# Altium project BLDC_2024_MCU_BOARD.PrjPcb
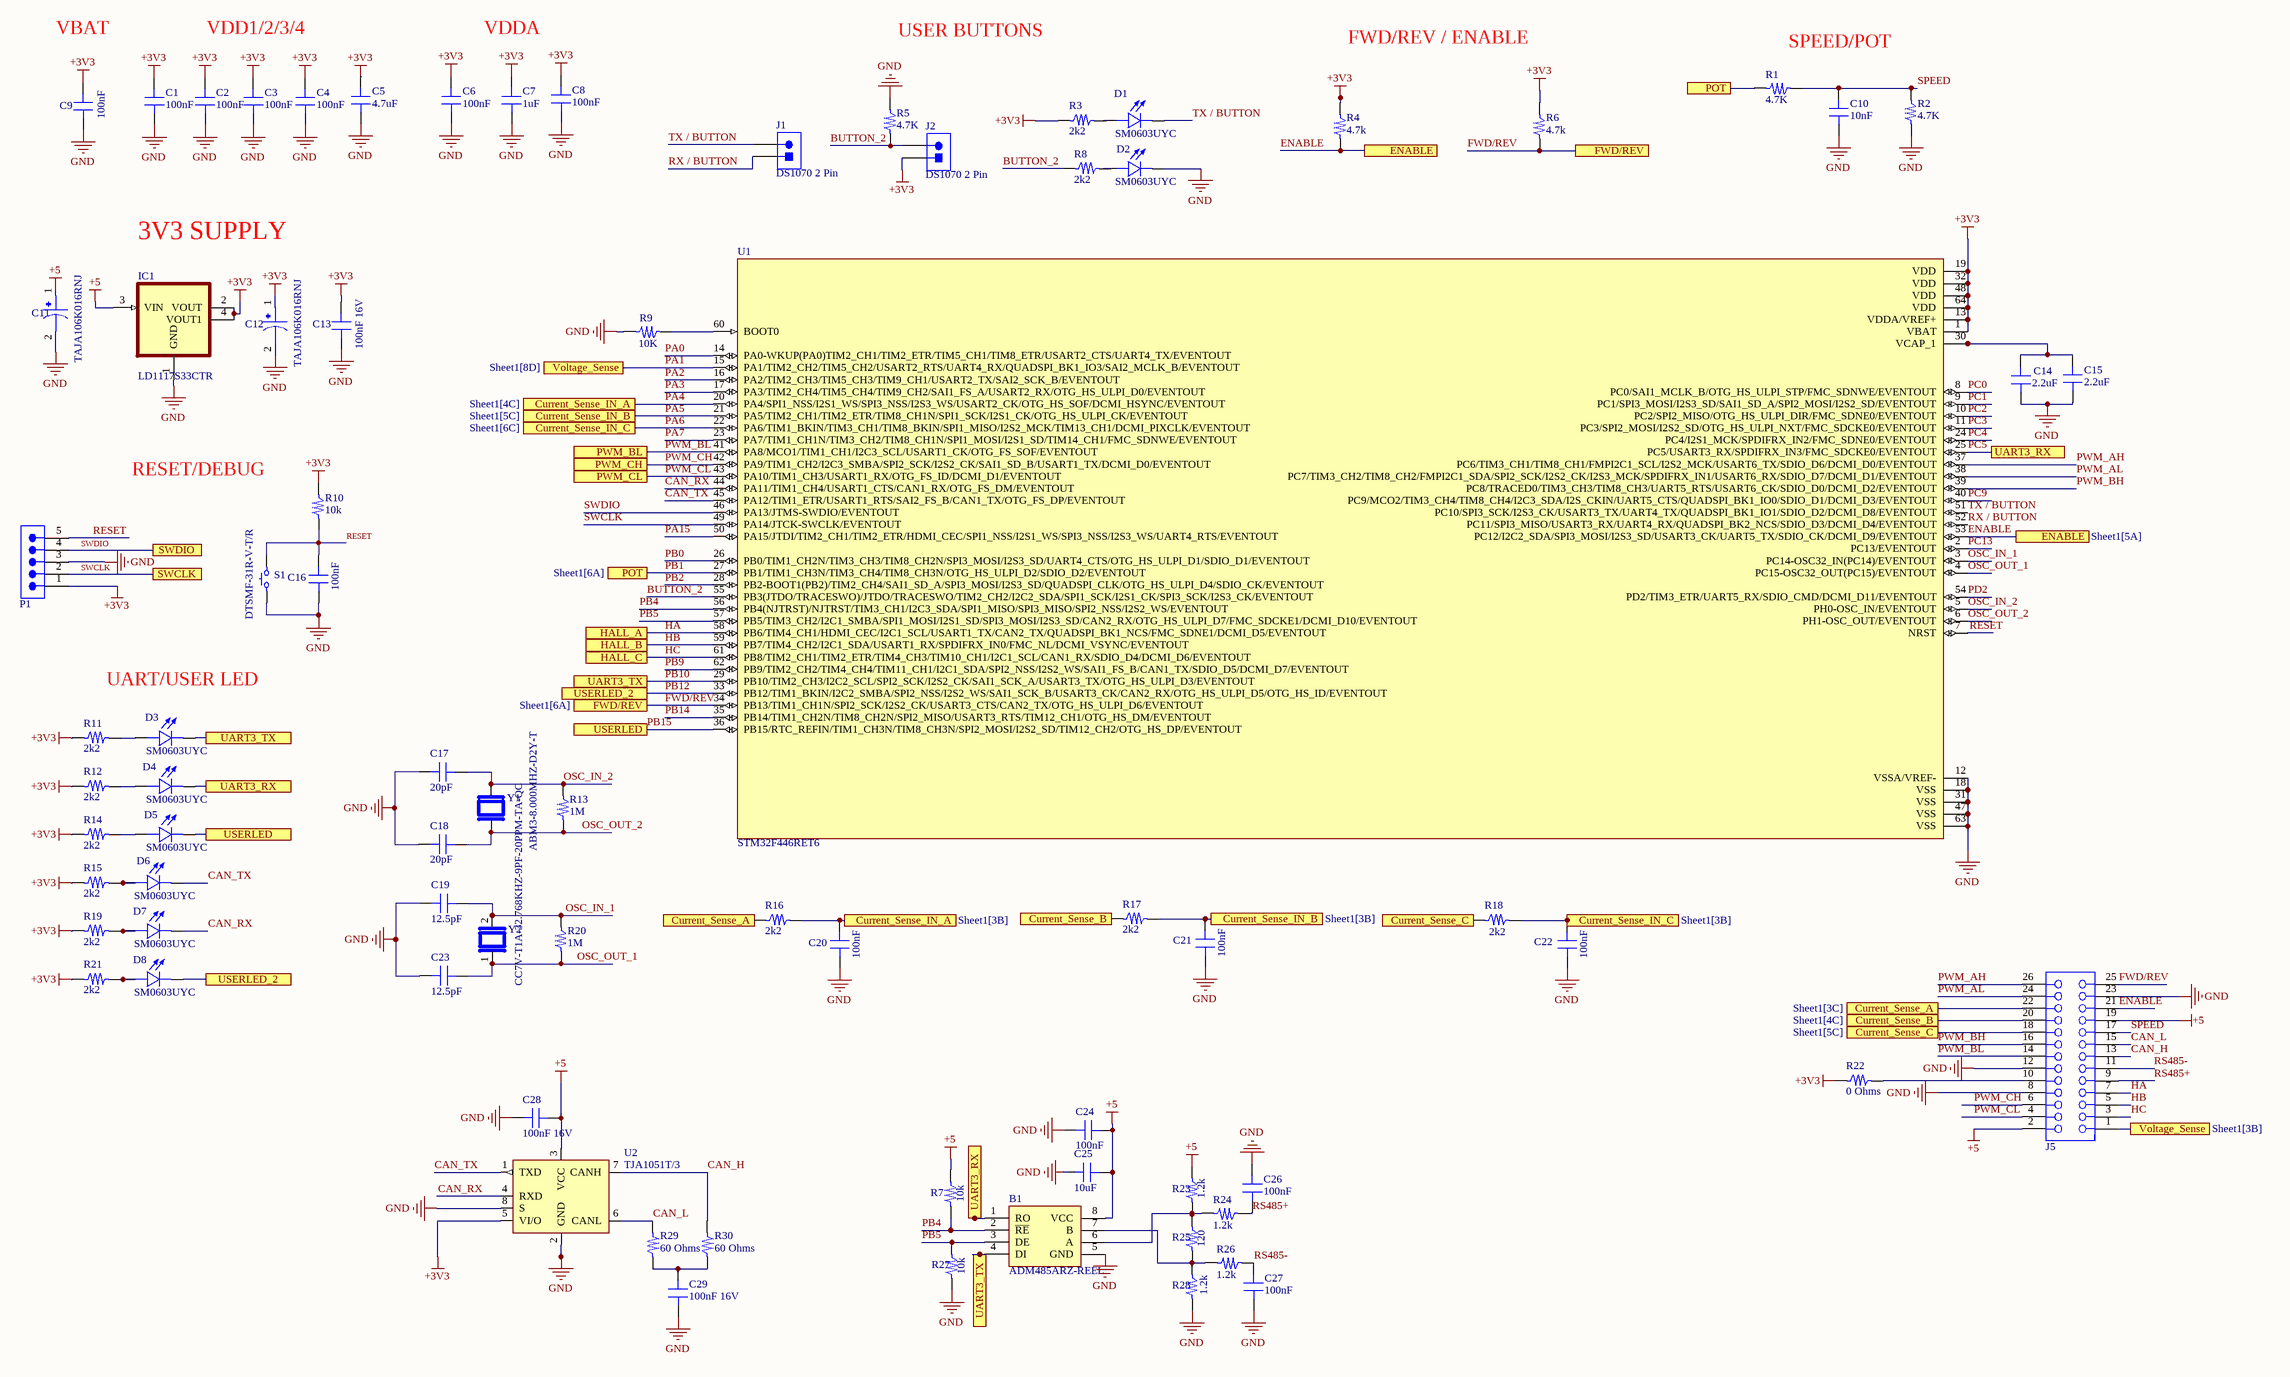
[diagram p0: Sheet1.SchDoc]
1 sheet, 78 parts. Net scope: flat (ports and power ports of the same name join across sheets).
Board file: PCB2.PcbDoc

## Sheet Sheet1.SchDoc
size A2; SheetNumber: 1; SheetTotal: 1

### Parts
B1  ADM485ARZ-REEL  [SOIC127P600X175-8N]
C1  100nF  [0603_CAP]
C2  100nF  [0603_CAP]
C3  100nF  [0603_CAP]
C4  100nF  [0603_CAP]
C5  4.7uF  [0603_CAP]
C6  100nF  [0603_CAP]
C7  1uF  [0603_CAP]
C8  100nF  [0603_CAP]
C9  100nF  [0603_CAP]
C10  10nF  [0603_CAP]
C11  TAJA106K016RNJ  [CAPMP3216X180N]
C12  TAJA106K016RNJ  [CAPMP3216X180N]
C13  100nF 16V  [0805_CAP]
C14  2.2uF  [0603_CAP]
C15  2.2uF  [0603_CAP]
C16  100nF  [0603_CAP]
C17  20pF  [0603_CAP]
C18  20pF  [0603_CAP]
C19  12.5pF  [0603_CAP]
C20  100nF  [0603_CAP]
C21  100nF  [0603_CAP]
C22  100nF  [0603_CAP]
C23  12.5pF  [0603_CAP]
C24  100nF  [0603_CAP]
C25  10uF  [0603_CAP]
C26  100nF  [0603_CAP]
C27  100nF  [0603_CAP]
C28  100nF 16V  [0603_CAP]
C29  100nF 16V  [0603_CAP]
D1  SM0603UYC  [LED_SM0603UYC]
D2  SM0603UYC  [LED_SM0603UYC]
D3  SM0603UYC  [LED_SM0603UYC]
D4  SM0603UYC  [LED_SM0603UYC]
D5  SM0603UYC  [LED_SM0603UYC]
D6  SM0603UYC  [LED_SM0603UYC]
D7  SM0603UYC  [LED_SM0603UYC]
D8  SM0603UYC  [LED_SM0603UYC]
IC1  LD1117S33CTR  [SOT223]
J1  DS1070 2 Pin  [2PIN_100mil]
J2  DS1070 2 Pin  [2PIN_100mil]
J5  61302621821  [61302621821]  (value not drawn)
P1  61300511121  [61300511121]  (value not drawn)
R1  4.7K  [0603_RES]
R2  4.7K  [0603_RES]
R3  2k2  [0603_RES]
R4  4.7k  [0603_RES]
R5  4.7K  [0603_RES]
R6  4.7k  [0603_RES]
R7  10k  [0603_RES]
R8  2k2  [0603_RES]
R9  10K  [0603_RES]
R10  10k  [0603_RES]
R11  2k2  [0603_RES]
R12  2k2  [0603_RES]
R13  1M  [0603_RES]
R14  2k2  [0603_RES]
R15  2k2  [0603_RES]
R16  2k2  [0603_RES]
R17  2k2  [0603_RES]
R18  2k2  [0603_RES]
R19  2k2  [0603_RES]
R20  1M  [0603_RES]
R21  2k2  [0603_RES]
R22  0 Ohms  [0805_RES]
R23  1.2k  [0603_RES]
R24  1.2k  [0603_RES]
R25  120  [0603_RES]
R26  1.2k  [0603_RES]
R27  10k  [0603_RES]
R28  1.2k  [0603_RES]
R29  60 Ohms  [0603_RES]
R30  60 Ohms  [0603_RES]
S1  DTSMF-31R-V-T/R  [Button]
U1  STM32F446RET6  [QFP50P1200X1200X160-64N]
U2  TJA1051T/3  [SOT96-1]
Y1  ABM3-8.000MHZ-D2Y-T  [XTAL_ABM3-8.000MHZ-D2Y-T]
Y2  CC7V-T1A-32.768KHZ-9PF-20PPM-TA-QC  [XTAL_CC7V-T1A-32.768KHZ-9PF-20PPM-TA-QC]

### Ports
Current_Sense_A (see Sheet1[3C]), Current_Sense_A (see Sheet1[7C]), Current_Sense_B (see Sheet1[4C]), Current_Sense_B (see Sheet1[7C]), Current_Sense_C (see Sheet1[5C]), Current_Sense_C (see Sheet1[7C]), Current_Sense_IN_A (see Sheet1[3B]), Current_Sense_IN_A (see Sheet1[4C]), Current_Sense_IN_B (see Sheet1[3B]), Current_Sense_IN_B (see Sheet1[5C]), Current_Sense_IN_C (see Sheet1[3B]), Current_Sense_IN_C (see Sheet1[6C]), ENABLE (see Sheet1[5A]), ENABLE (see Sheet1[7B]), FWD/REV (see Sheet1[3C]), FWD/REV (see Sheet1[6A]), HALL_A, HALL_B, HALL_C, POT (see Sheet1[3B]), POT (see Sheet1[6A]), PWM_BL, PWM_CH, PWM_CL, SWCLK, SWDIO, UART3_RX (see Sheet1[2C], Sheet1[4D]), UART3_RX (see Sheet1[2C], Sheet1[7B]), UART3_RX (see Sheet1[4D], Sheet1[7B]), UART3_TX (see Sheet1[2C], Sheet1[3C]), UART3_TX (see Sheet1[2C], Sheet1[4D]), UART3_TX (see Sheet1[3C], Sheet1[4D]), USERLED (see Sheet1[2C]), USERLED (see Sheet1[3C]), USERLED_2 (see Sheet1[2C]), USERLED_2 (see Sheet1[3C]), Voltage_Sense (see Sheet1[3B]), Voltage_Sense (see Sheet1[8D])

### Nets
+3V3: C1.1 C2.1 C3.1 C4.1 C5.1 C6.1 C7.1 C8.1 C9.1 C12.1 C13.2 IC1.2(VOUT) IC1.4(VOUT1) J2.1 P1.1 R3.1 R4.2 R6.2 R10.2 R11.1 R12.1 R14.1 R15.1 R19.1 R21.1 R22.1 U1.1(VBAT) U1.13(VDDA/VREF+) U1.19(VDD) U1.32(VDD) U1.48(VDD) U1.64(VDD) U2.5(VI/O)
+5: B1.8(VCC) C11.1 C24.1 C25.1 C28.2 IC1.3(VIN) J5.2 J5.19 R7.2 R23.2 U2.3(VCC)
GND: B1.5(GND) C1.2 C2.2 C3.2 C4.2 C5.2 C6.2 C7.2 C8.2 C9.2 C10.2 C11.2 C12.2 C13.1 C14.2 C15.2 C16.2 C17.1 C18.1 C19.1 C20.2 C21.2 C22.2 C23.1 C24.2 C25.2 C26.1 C27.2 C28.1 C29.2 D2.C IC1.1(GND) J5.8 J5.12 J5.23 P1.3 R2.1 R5.2 R9.2 R27.1 R28.1 S1.1 U1.12(VSSA/VREF-) U1.18(VSS) U1.31(VSS) U1.47(VSS) U1.63(VSS) U2.2(GND) U2.8(S)
BUTTON_2: J2.2 R5.1 R8.1 U1.55(PB3(JTDO/TRACESWO)/JTDO/TRACESWO/TIM2_CH2/I2C2_SDA/SPI1_SCK/I2S1_CK/SPI3_SCK/I2S3_CK/EVENTOUT)
CAN_H: J5.13 R30.1 U2.7(CANH)
CAN_L: J5.15 R29.1 U2.6(CANL)
CAN_RX: D7.C U1.44(PA11/TIM1_CH4/USART1_CTS/CAN1_RX/OTG_FS_DM/EVENTOUT) U2.4(RXD)
CAN_TX: D6.C U1.45(PA12/TIM1_ETR/USART1_RTS/SAI2_FS_B/CAN1_TX/OTG_FS_DP/EVENTOUT) U2.1(TXD)
ENABLE: J5.21 R4.1 U1.53(PC12/I2C2_SDA/SPI3_MOSI/I2S3_SD/USART3_CK/UART5_TX/SDIO_CK/DCMI_D9/EVENTOUT) ; port ENABLE
FWD/REV: J5.25 R6.1 U1.34(PB13/TIM1_CH1N/SPI2_SCK/I2S2_CK/USART3_CTS/CAN2_TX/OTG_HS_ULPI_D6/EVENTOUT) ; port FWD/REV
HA: J5.7 U1.58(PB6/TIM4_CH1/HDMI_CEC/I2C1_SCL/USART1_TX/CAN2_TX/QUADSPI_BK1_NCS/FMC_SDNE1/DCMI_D5/EVENTOUT) ; port HALL_A
HB: J5.5 U1.59(PB7/TIM4_CH2/I2C1_SDA/USART1_RX/SPDIFRX_IN0/FMC_NL/DCMI_VSYNC/EVENTOUT) ; port HALL_B
HC: J5.3 U1.61(PB8/TIM2_CH1/TIM2_ETR/TIM4_CH3/TIM10_CH1/I2C1_SCL/CAN1_RX/SDIO_D4/DCMI_D6/EVENTOUT) ; port HALL_C
OSC_IN_1: C19.2 R20.2 U1.3(PC14-OSC32_IN(PC14)/EVENTOUT) Y2.2
OSC_IN_2: C17.2 R13.2 U1.5(PH0-OSC_IN/EVENTOUT) Y1.2
OSC_OUT_1: C23.2 R20.1 U1.4(PC15-OSC32_OUT(PC15)/EVENTOUT) Y2.1
OSC_OUT_2: C18.2 R13.1 U1.6(PH1-OSC_OUT/EVENTOUT) Y1.1
PA0: U1.14(PA0-WKUP(PA0)TIM2_CH1/TIM2_ETR/TIM5_CH1/TIM8_ETR/USART2_CTS/UART4_TX/EVENTOUT)
PA1: J5.1 U1.15(PA1/TIM2_CH2/TIM5_CH2/USART2_RTS/UART4_RX/QUADSPI_BK1_IO3/SAI2_MCLK_B/EVENTOUT) ; port Voltage_Sense
PA2: U1.16(PA2/TIM2_CH3/TIM5_CH3/TIM9_CH1/USART2_TX/SAI2_SCK_B/EVENTOUT)
PA3: U1.17(PA3/TIM2_CH4/TIM5_CH4/TIM9_CH2/SAI1_FS_A/USART2_RX/OTG_HS_ULPI_D0/EVENTOUT)
PA4: C20.1 R16.2 U1.20(PA4/SPI1_NSS/I2S1_WS/SPI3_NSS/I2S3_WS/USART2_CK/OTG_HS_SOF/DCMI_HSYNC/EVENTOUT) ; port Current_Sense_IN_A
PA5: C21.1 R17.2 U1.21(PA5/TIM2_CH1/TIM2_ETR/TIM8_CH1N/SPI1_SCK/I2S1_CK/OTG_HS_ULPI_CK/EVENTOUT) ; port Current_Sense_IN_B
PA6: C22.1 R18.2 U1.22(PA6/TIM1_BKIN/TIM3_CH1/TIM8_BKIN/SPI1_MISO/I2S2_MCK/TIM13_CH1/DCMI_PIXCLK/EVENTOUT) ; port Current_Sense_IN_C
PA7: U1.23(PA7/TIM1_CH1N/TIM3_CH2/TIM8_CH1N/SPI1_MOSI/I2S1_SD/TIM14_CH1/FMC_SDNWE/EVENTOUT)
PA15: U1.50(PA15/JTDI/TIM2_CH1/TIM2_ETR/HDMI_CEC/SPI1_NSS/I2S1_WS/SPI3_NSS/I2S3_WS/UART4_RTS/EVENTOUT)
PB0: U1.26(PB0/TIM1_CH2N/TIM3_CH3/TIM8_CH2N/SPI3_MOSI/I2S3_SD/UART4_CTS/OTG_HS_ULPI_D1/SDIO_D1/EVENTOUT)
PB1: R1.2 U1.27(PB1/TIM1_CH3N/TIM3_CH4/TIM8_CH3N/OTG_HS_ULPI_D2/SDIO_D2/EVENTOUT) ; port POT
PB2: U1.28(PB2-BOOT1(PB2)/TIM2_CH4/SAI1_SD_A/SPI3_MOSI/I2S3_SD/QUADSPI_CLK/OTG_HS_ULPI_D4/SDIO_CK/EVENTOUT)
PB4: B1.2(~{RE}) R7.1 U1.56(PB4(NJTRST)/NJTRST/TIM3_CH1/I2C3_SDA/SPI1_MISO/SPI3_MISO/SPI2_NSS/I2S2_WS/EVENTOUT)
PB5: B1.3(DE) R27.2 U1.57(PB5/TIM3_CH2/I2C1_SMBA/SPI1_MOSI/I2S1_SD/SPI3_MOSI/I2S3_SD/CAN2_RX/OTG_HS_ULPI_D7/FMC_SDCKE1/DCMI_D10/EVENTOUT)
PB9: U1.62(PB9/TIM2_CH2/TIM4_CH4/TIM11_CH1/I2C1_SDA/SPI2_NSS/I2S2_WS/SAI1_FS_B/CAN1_TX/SDIO_D5/DCMI_D7/EVENTOUT)
PB10: B1.4(DI) D3.C U1.29(PB10/TIM2_CH3/I2C2_SCL/SPI2_SCK/I2S2_CK/SAI1_SCK_A/USART3_TX/OTG_HS_ULPI_D3/EVENTOUT) ; port UART3_TX
PB12: D8.C U1.33(PB12/TIM1_BKIN/I2C2_SMBA/SPI2_NSS/I2S2_WS/SAI1_SCK_B/USART3_CK/CAN2_RX/OTG_HS_ULPI_D5/OTG_HS_ID/EVENTOUT) ; port USERLED_2
PB14: U1.35(PB14/TIM1_CH2N/TIM8_CH2N/SPI2_MISO/USART3_RTS/TIM12_CH1/OTG_HS_DM/EVENTOUT)
PB15: D5.C U1.36(PB15/RTC_REFIN/TIM1_CH3N/TIM8_CH3N/SPI2_MOSI/I2S2_SD/TIM12_CH2/OTG_HS_DP/EVENTOUT) ; port USERLED
PC0: U1.8(PC0/SAI1_MCLK_B/OTG_HS_ULPI_STP/FMC_SDNWE/EVENTOUT)
PC1: U1.9(PC1/SPI3_MOSI/I2S3_SD/SAI1_SD_A/SPI2_MOSI/I2S2_SD/EVENTOUT)
PC2: U1.10(PC2/SPI2_MISO/OTG_HS_ULPI_DIR/FMC_SDNE0/EVENTOUT)
PC3: U1.11(PC3/SPI2_MOSI/I2S2_SD/OTG_HS_ULPI_NXT/FMC_SDCKE0/EVENTOUT)
PC4: U1.24(PC4/I2S1_MCK/SPDIFRX_IN2/FMC_SDNE0/EVENTOUT)
PC5: B1.1(RO) D4.C U1.25(PC5/USART3_RX/SPDIFRX_IN3/FMC_SDCKE0/EVENTOUT) ; port UART3_RX
PC9: U1.40(PC9/MCO2/TIM3_CH4/TIM8_CH4/I2C3_SDA/I2S_CKIN/UART5_CTS/QUADSPI_BK1_IO0/SDIO_D1/DCMI_D3/EVENTOUT)
PC13: U1.2(PC13/EVENTOUT)
PD2: U1.54(PD2/TIM3_ETR/UART5_RX/SDIO_CMD/DCMI_D11/EVENTOUT)
PWM_AH: J5.26 U1.37(PC6/TIM3_CH1/TIM8_CH1/FMPI2C1_SCL/I2S2_MCK/USART6_TX/SDIO_D6/DCMI_D0/EVENTOUT)
PWM_AL: J5.24 U1.38(PC7/TIM3_CH2/TIM8_CH2/FMPI2C1_SDA/SPI2_SCK/I2S2_CK/I2S3_MCK/SPDIFRX_IN1/USART6_RX/SDIO_D7/DCMI_D1/EVENTOUT)
PWM_BH: J5.16 U1.39(PC8/TRACED0/TIM3_CH3/TIM8_CH3/UART5_RTS/USART6_CK/SDIO_D0/DCMI_D2/EVENTOUT)
PWM_BL: J5.14 U1.41(PA8/MCO1/TIM1_CH1/I2C3_SCL/USART1_CK/OTG_FS_SOF/EVENTOUT) ; port PWM_BL
PWM_CH: J5.6 U1.42(PA9/TIM1_CH2/I2C3_SMBA/SPI2_SCK/I2S2_CK/SAI1_SD_B/USART1_TX/DCMI_D0/EVENTOUT) ; port PWM_CH
PWM_CL: J5.4 U1.43(PA10/TIM1_CH3/USART1_RX/OTG_FS_ID/DCMI_D1/EVENTOUT) ; port PWM_CL
RESET: C16.1 P1.5 R10.1 S1.2 U1.7(NRST)
RS485+: C26.2 J5.9 R24.1
RS485-: C27.1 J5.11 R26.1
RX / BUTTON: J1.1 U1.52(PC11/SPI3_MISO/USART3_RX/UART4_RX/QUADSPI_BK2_NCS/SDIO_D3/DCMI_D4/EVENTOUT)
SPEED: C10.1 J5.17 R1.1 R2.2
SWCLK: P1.2 U1.49(PA14/JTCK-SWCLK/EVENTOUT) ; port SWCLK
SWDIO: P1.4 U1.46(PA13/JTMS-SWDIO/EVENTOUT) ; port SWDIO
TX / BUTTON: D1.C J1.2 U1.51(PC10/SPI3_SCK/I2S3_CK/USART3_TX/UART4_TX/QUADSPI_BK1_IO1/SDIO_D2/DCMI_D8/EVENTOUT)
NetB1_6: B1.6(A) R23.1 R24.2 R25.2
NetB1_7: B1.7(B) R25.1 R26.2 R28.2
NetC14_1: C14.1 C15.1 U1.30(VCAP_1)
NetC29_1: C29.1 R29.2 R30.2
NetD1_A: D1.A R3.2
NetD2_A: D2.A R8.2
NetD3_A: D3.A R11.2
NetD4_A: D4.A R12.2
NetD5_A: D5.A R14.2
NetD6_A: D6.A R15.2
NetD7_A: D7.A R19.2
NetD8_A: D8.A R21.2
NetJ5_10: J5.10 R22.2
NetJ5_18: J5.18 R18.1 ; port Current_Sense_C
NetJ5_20: J5.20 R17.1 ; port Current_Sense_B
NetJ5_22: J5.22 R16.1 ; port Current_Sense_A
NetR9_1: R9.1 U1.60(BOOT0)

### Notes on the sheet
- VBAT
- VDD1/2/3/4
- VDDA
- USER BUTTONS
- FWD/REV / ENABLE
- SPEED/POT
- 3V3 SUPPLY
- RESET/DEBUG
- UART/USER LED

### Library data of the parts
B1 = ADM485ARZ-REEL: RS-422/RS-485 Interface IC RS-485 I/F TRANSCEIVER; Manufacturer_Name: Analog Devices; Geometry.Height: 1.75mm; Manufacturer_Part_Number: ADM485ARZ-REEL; Mouser Part Number: 584-ADM485ARZ-R; Mouser Price/Stock: https://www.mouser.co.uk/ProductDetail/Analog-Devices/ADM485ARZ-REEL?qs=BpaRKvA4VqEQkRKEKZjbCg%3D%3D; Arrow Part Number: ADM485ARZ-REEL; Arrow Price/Stock: https://www.arrow.com/en/products/adm485arz-reel/analog-devices?region=nac; Datasheet Link: https://www.analog.com/media/en/technical-documentation/data-sheets/adm485.pdf
C1-C9 C14-C27 = CAP_0603: CL10B105KO8NNNC - MLCC (1608) 0603 1uF 16VDC ±10% X7R; Value: 1uF 16V
C10 = CAP_0603: CL10B105KO8NNNC - MLCC (1608) 0603 1uF 16VDC ±10% X7R; Value: 100nF 16V
C11 C12 = TAJA106K016RNJ: 10ÂµF Molded Tantalum Capacitors 16V 1206 (3216 Metric) 3Ohm; MF: AVX; MP: TAJA106K016RNJ; Price: None; Availability: Warning; SnapEDA_Link: https://www.snapeda.com/parts/TAJA106K016RNJ/AVX%20/%20Kyocera/view-part/47127/?ref=snap; Arrow_Electronics-Purchase-URL: https://snapeda.com/shop?store=Arrow+Electronics&id=47127; Value: *; Mouser-Purchase-URL: https://snapeda.com/shop?store=Mouser&id=47127; Package: 1206 AVX; Check_prices: https://www.snapeda.com/parts/TAJA106K016RNJ/AVX%20/%20Kyocera/view-part/47127/?ref=eda
C13 = CAP_0805: Value: 100nF 16V
C28 C29 = CAP_0603: CL10B105KO8NNNC - MLCC (1608) 0603 1uF 16VDC ±10% X7R; Value: 100nF 16V
D1-D8 = SM0603UYC: LED SMD 0603 Ultra Yellow 593nm 70mcd Water Clear Lens 130 Deg Viewing Angle | Bivar Inc. SM0603UYC; SnapEDA_Link: https://www.snapeda.com/parts/SM0603UYC/Bivar/view-part/?ref=snap; Package: 0603 Bivar; Value: *; MF: Bivar; MP: SM0603UYC; Check_prices: https://www.snapeda.com/parts/SM0603UYC/Bivar/view-part/?ref=eda
IC1 = LD1117S33CTR: Linear Voltage Regulator IC Positive Fixed 1 Output 800mA SOT-223; MF: STMicroelectronics; SnapEDA_Link: https://www.snapeda.com/parts/LD1117S33CTR/STMicroelectronics/view-part/?ref=snap; Package: SOT-223 STMicroelectronics; Value: *; MP: LD1117S33CTR; Check_prices: https://www.snapeda.com/parts/LD1117S33CTR/STMicroelectronics/view-part/?ref=eda
J1 J2 = 2 Pin Socket: 2pin Socket 100mil
J5 = 61302621821: WR-PHD Socket Header, THT, Vertical, pitch 2.54mm, 2 Row, 26P; Manufacturer: Wurth Elektronik; Contact Resistance: 20mOhm; Rated Current: 3A; Working Voltage: 250V; Withstanding Voltage: 500V; Manufacturer Part Number: 61302621821; Category: Board-to-Board Connectors; Match Code: WR-PHD; ComponentLink1Description: Website Link; ComponentLink1URL: https://www.we-online.com/redexpert/article/61302621821?ad; ComponentLink2Description: Datasheet Link; ComponentLink2URL: https://www.we-online.com/redexpert/spec/61302621821?ad; Mount: Through Hole; Operating Temperature Max: 125°C; Operating Temperature Min: -40°C; Packaging: Tray; Gender: Socket Header; Number of Pins: 26; Number of Rows: 2; Orientation: Vertical; Pitch: 2.54mm
P1 = 61300511121: WR-PHD Pin Header, THT, Vertical, pitch 2.54mm, 1 Row, 5P; Manufacturer: Wurth Elektronik; Contact Resistance: 20mOhm; Rated Current: 3A; Working Voltage: 250V; Withstanding Voltage: 500V; Manufacturer Part Number: 61300511121; Category: Board-to-Board Connectors; Match Code: WR-PHD; ComponentLink1Description: Website Link; ComponentLink1URL: https://www.we-online.com/redexpert/article/61300511121?ad; ComponentLink2Description: Datasheet Link; ComponentLink2URL: https://www.we-online.com/redexpert/spec/61300511121?ad; Mount: Through Hole; Operating Temperature Max: 105°C; Operating Temperature Min: -40°C; Packaging: Bag; Gender: Pin Header; Number of Pins: 5; Number of Rows: 1; Orientation: Vertical; Pitch: 2.54mm
R1-R21 R23-R28 = RES_0603: 0603; Value: 0/10 Ohms; Power: 1/8W
R22 = RES_0805: 0805; Value: 1k Ohms; Power: 1/8 W
R29 R30 = 1k Ohms
S1 = DTSMF-31R-V-T/R: DTSMF-31R-V-T/R - SWITCH TACT 6.00x3.50 4.30mm 260gF SMT V/T; ComponentLink1Description: özdisan; ComponentLink1URL: https://ozdisan.com/elektromekanik-komponentler/sivicler-ve-anahtarlar/tact-sivicler/DTSMF-31R-V-TR
U1 = STM32F446RET6: MCU 32-Bit STM32 ARM Cortex M4 RISC 512KB Flash 2.5V/3.3V 64-Pin LQFP Tray; Availability: Unavailable; Package: None; MP: STM32F446RET6; Value: *; Price: None
U2 = TJA1051T/3: 1/1 ÐŸÑ€Ð¸ÐµÐ¼Ð¾Ð¿ÐµÑ€ÐµÐ´Ð°Ñ‚Ñ‡Ð¸Ðº ÐŸÐ¾Ð»Ð¾Ð²Ð¸Ð½Ð° CANbus 8-SO; MF: NXP USA; Price: None; Availability: In Stock; Purchase-URL: https://pricing.snapeda.com/search/part/TJA1051T/3/?ref=eda; SnapEDA_Link: https://www.snapeda.com/parts/TJA1051T/3/NXP+USA+Inc./view-part/?ref=snap; MP: TJA1051T/3; Value: *; Check_prices: https://www.snapeda.com/parts/TJA1051T/3/NXP+USA+Inc./view-part/?ref=eda; Package: SO-8 NXP Semiconductors
Y1 = ABM3-8.000MHZ-D2Y-T: 8 MHz Â±20ppm Crystal 18pF 140 Ohms 2-SMD, No Lead; MF: Abracon; Purchase-URL: https://pricing.snapeda.com/search/part/ABM3-8.000MHZ-D2Y-T/?ref=eda; MP: ABM3-8.000MHZ-D2Y-T; SnapEDA_Link: https://www.snapeda.com/parts/ABM3-8.000MHZ-D2Y-T/Abracon+LLC/view-part/?ref=snap; Value: *; Package: SMD-2 Abracon; Price: None; Availability: In Stock; Check_prices: https://www.snapeda.com/parts/ABM3-8.000MHZ-D2Y-T/Abracon+LLC/view-part/?ref=eda
Y2 = CC7V-T1A-32.768KHZ-9PF-20PPM-TA-QC: LOW FREQUENCY CRYSTAL; MF: Micro Crystal; SnapEDA_Link: https://www.snapeda.com/parts/CC7V-T1A-32.768kHz-9pF-20PPM-TA-QC/Micro+Crystal/view-part/?ref=snap; Package: SMD-2 Micro Crystal; Value: *; MP: CC7V-T1A-32.768kHz-9pF-20PPM-TA-QC; Check_prices: https://www.snapeda.com/parts/CC7V-T1A-32.768kHz-9pF-20PPM-TA-QC/Micro+Crystal/view-part/?ref=eda